# Altium schematic sheet lcd.SchDoc
size A4
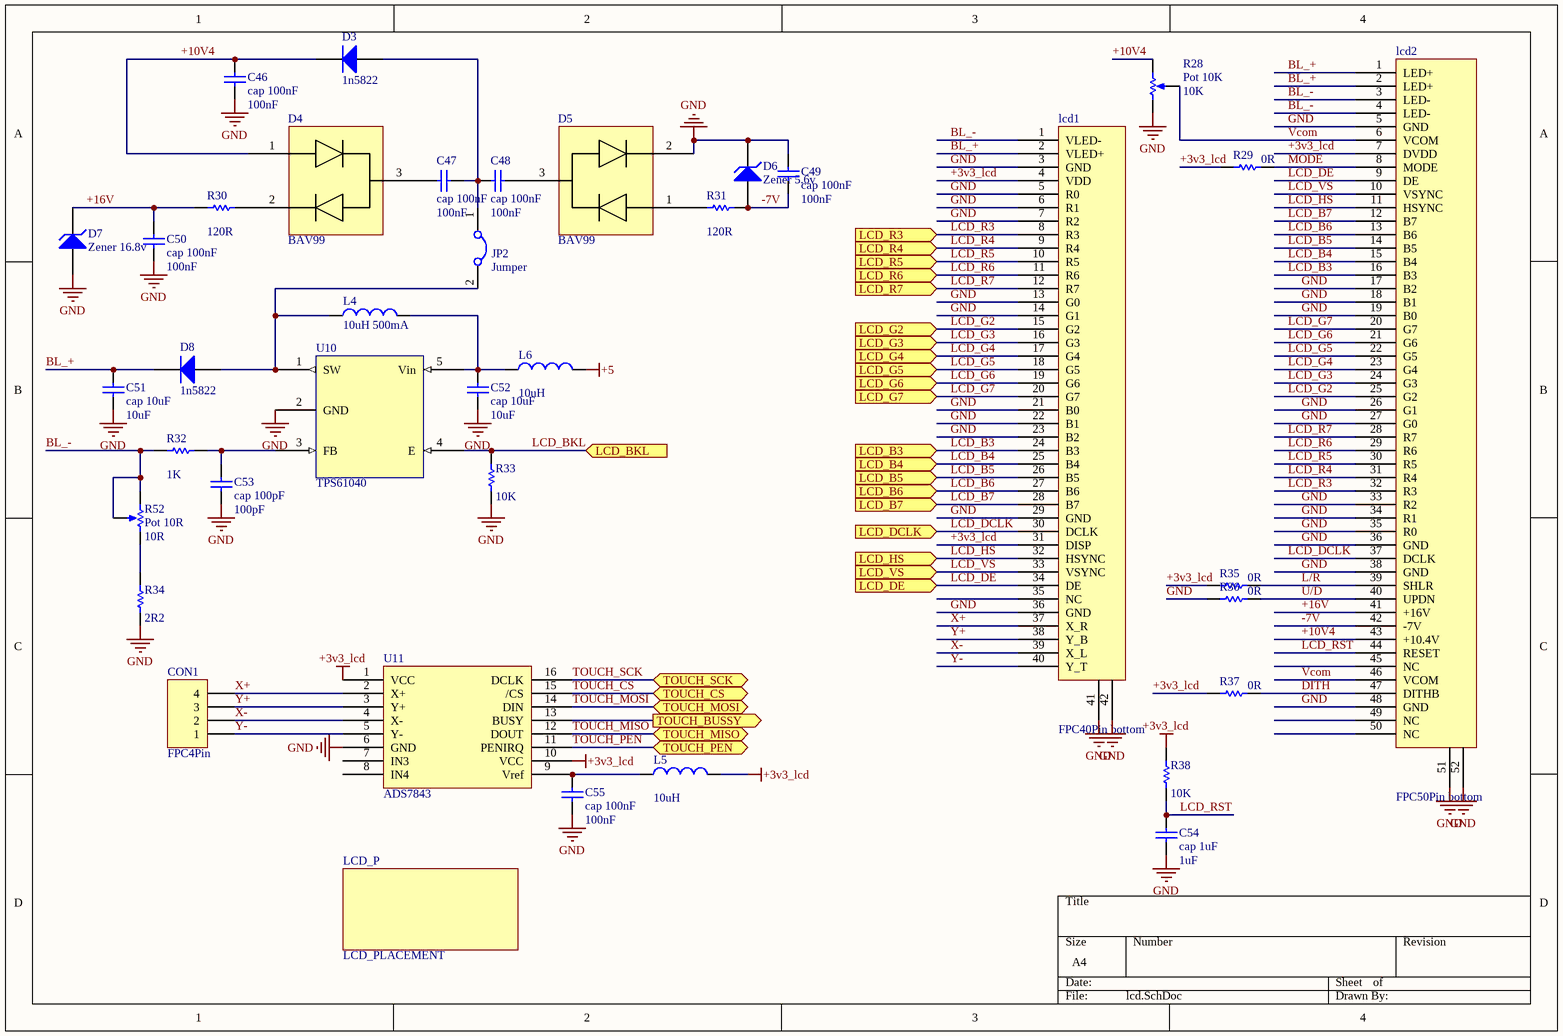
[diagram p0: lcd.SchDoc]

## Parts
C46  cap 100nF  value 100nF  [Cap 805]
C47  cap 100nF  value 100nF  [Cap 805]
C48  cap 100nF  value 100nF  [Cap 805]
C49  cap 100nF  value 100nF  [Cap 805]
C50  cap 100nF  value 100nF  [Cap 805]
C51  cap 10uF  value 10uF  [Cap 805]
C52  cap 10uF  value 10uF  [Cap 805]
C53  cap 100pF  value 100pF  [Cap 805]
C54  cap 1uF  value 1uF  [Cap 805]
C55  cap 100nF  value 100nF  [Cap 805]
CON1  FPC4Pin  [FPC-4pin-1mm]
D3  1n5822  [SMA DIODE 2]
D4  BAV99  [SOT23_BEC_N]
D5  BAV99  [SOT23_BEC_N]
D6  Zener 5.6v  [Diode 1n4148 SMD]
D7  Zener 16.8v  [Diode 1n4148 SMD]
D8  1n5822  [SMA DIODE 2]
JP2  Jumper  [Jumper Small - 2.54 - GRAY]  (no BOM)
L4  value 10uH 500mA  [Inductor SMD 3x3.2mm]  (hidden comment: inductor 10uH 500mA)
L5  value 10uH  [IND1206]  (hidden comment: inductor 10uH)
L6  value 10uH  [IND1206]  (hidden comment: inductor 10uH)
lcd1  FPC40Pin bottom  [FPC40]
lcd2  FPC50Pin bottom  [FPC50pin]
LCD_P  LCD_PLACEMENT  [LCD_7"_placement]  (no BOM)
R28  Pot 10K  value 10K  [Multi Turn 02]
R29  value 0R  [RES 0805 (2012X06L)]  (hidden comment: Res 0R)
R30  value 120R  [RES 0805 (2012X06L)]  (hidden comment: Res 120R)
R31  value 120R  [RES 0805 (2012X06L)]  (hidden comment: Res 120R)
R32  value 1K  [RES 0805 (2012X06L)]  (hidden comment: Res 1K)
R33  value 10K  [RES 0805 (2012X06L)]  (hidden comment: Res 10K)
R34  value 2R2  [RES 0805 (2012X06L)]  (hidden comment: Res 2R2)
R35  value 0R  [RES 0805 (2012X06L)]  (hidden comment: Res 0R)
R36  value 0R  [RES 0805 (2012X06L)]  (hidden comment: Res 0R)
R37  value 0R  [RES 0805 (2012X06L)]  (hidden comment: Res 0R)
R38  value 10K  [RES 0805 (2012X06L)]  (hidden comment: Res 10K)
R52  Pot 10R  value 10R  [Multi Turn 02]
U10  TPS61040  [SOT23-5_N]
U11  ADS7843  [XPT]

## Ports
LCD_B3 (in), LCD_B4 (in), LCD_B5 (in), LCD_B6 (in), LCD_B7 (in), LCD_BKL (in), LCD_DCLK (in), LCD_DE (in), LCD_G2 (in), LCD_G3 (in), LCD_G4 (in), LCD_G5 (in), LCD_G6 (in), LCD_G7 (in), LCD_HS (in), LCD_R3 (in), LCD_R4 (in), LCD_R5 (in), LCD_R6 (in), LCD_R7 (in), LCD_VS (in), TOUCH_BUSSY (out), TOUCH_CS (bidir), TOUCH_MISO (bidir), TOUCH_MOSI (bidir), TOUCH_PEN (bidir), TOUCH_SCK (bidir)

## Nets
+3v3_lcd: L5.2 lcd1.4(VDD) lcd1.31(DISP) lcd2.7(DVDD) R29.2 R35.2 R37.2 R38.2 U11.1(VCC) U11.10(VCC)
+5: L6.2
GND: C46.2 C49.1 C50.2 C51.2 C52.2 C53.2 C54.1 C55.2 D5.2 D6.2(K) D7.1(A) lcd1.3(GND) lcd1.5(R0) lcd1.6(R1) lcd1.7(R2) lcd1.13(G0) lcd1.14(G1) lcd1.21(B0) lcd1.22(B1) lcd1.23(B2) lcd1.29(GND) lcd1.36(GND) lcd1.41 lcd1.42 lcd2.5(GND) lcd2.17(B2) lcd2.18(B1) lcd2.19(B0) lcd2.26(G1) lcd2.27(G0) lcd2.33(R2) lcd2.34(R1) lcd2.35(R0) lcd2.36(GND) lcd2.38(GND) lcd2.48(GND) lcd2.51 lcd2.52 R28.1(TOP) R33.1 R34.1 R36.2 U10.2(GND) U11.6(GND)
+10V4: C46.1 D3.2(K) D4.1 lcd2.43(+10.4V) R28.2(BOT)
+16V: C50.1 D7.2(K) lcd2.41(+16V) R30.2
-7V: C49.2 D6.1(A) lcd2.42(-7V) R31.1
BL_+: C51.1 D8.2(K) lcd1.2(VLED+) lcd2.1(LED+) lcd2.2(LED+)
BL_-: lcd1.1(VLED-) lcd2.3(LED-) lcd2.4(LED-) R32.2 R52.1(TOP) R52.3(TAP)
DITH: lcd2.47(DITHB) R37.1
L/R: lcd2.39(SHLR) R35.1
LCD_B3: lcd1.24(B3) lcd2.16(B3) ; port LCD_B3
LCD_B4: lcd1.25(B4) lcd2.15(B4) ; port LCD_B4
LCD_B5: lcd1.26(B5) lcd2.14(B5) ; port LCD_B5
LCD_B6: lcd1.27(B6) lcd2.13(B6) ; port LCD_B6
LCD_B7: lcd1.28(B7) lcd2.12(B7) ; port LCD_B7
LCD_BKL: R33.2 U10.4(E) ; port LCD_BKL
LCD_DCLK: lcd1.30(DCLK) lcd2.37(DCLK) ; port LCD_DCLK
LCD_DE: lcd1.34(DE) lcd2.9(DE) ; port LCD_DE
LCD_G2: lcd1.15(G2) lcd2.25(G2) ; port LCD_G2
LCD_G3: lcd1.16(G3) lcd2.24(G3) ; port LCD_G3
LCD_G4: lcd1.17(G4) lcd2.23(G4) ; port LCD_G4
LCD_G5: lcd1.18(G5) lcd2.22(G5) ; port LCD_G5
LCD_G6: lcd1.19(G6) lcd2.21(G6) ; port LCD_G6
LCD_G7: lcd1.20(G7) lcd2.20(G7) ; port LCD_G7
LCD_HS: lcd1.32(HSYNC) lcd2.11(HSYNC) ; port LCD_HS
LCD_R3: lcd1.8(R3) lcd2.32(R3) ; port LCD_R3
LCD_R4: lcd1.9(R4) lcd2.31(R4) ; port LCD_R4
LCD_R5: lcd1.10(R5) lcd2.30(R5) ; port LCD_R5
LCD_R6: lcd1.11(R6) lcd2.29(R6) ; port LCD_R6
LCD_R7: lcd1.12(R7) lcd2.28(R7) ; port LCD_R7
LCD_RST: C54.2 lcd2.44(RESET) R38.1
LCD_VS: lcd1.33(VSYNC) lcd2.10(VSYNC) ; port LCD_VS
MODE: lcd2.8(MODE) R29.1
TOUCH_BUSSY: U11.13(BUSY) ; port TOUCH_BUSSY
TOUCH_CS: U11.15(/CS) ; port TOUCH_CS
TOUCH_MISO: U11.12(DOUT) ; port TOUCH_MISO
TOUCH_MOSI: U11.14(DIN) ; port TOUCH_MOSI
TOUCH_PEN: U11.11(PENIRQ) ; port TOUCH_PEN
TOUCH_SCK: U11.16(DCLK) ; port TOUCH_SCK
U/D: lcd2.40(UPDN) R36.1
Vcom: lcd2.6(VCOM) lcd2.46(VCOM) R28.3(TAP)
X+: CON1.4 lcd1.37(X_R) U11.2(X+)
X-: CON1.2 lcd1.39(X_L) U11.4(X-)
Y+: CON1.3 lcd1.38(Y_B) U11.3(Y+)
Y-: CON1.1 lcd1.40(Y_T) U11.5(Y-)
NetC47_1: C47.1 C48.2 D3.1(A) JP2.1
NetC47_2: C47.2 D4.3
NetC48_1: C48.1 D5.3
NetC52_1: C52.1 L4.2 L6.1 U10.5(Vin)
NetC53_1: C53.1 R32.1 U10.3(FB)
NetC55_1: C55.1 L5.1 U11.9(Vref)
NetD4_2: D4.2 R30.1
NetD5_1: D5.1 R31.2
NetD8_1: D8.1(A) JP2.2 L4.1 U10.1(SW)
NetR34_2: R34.2 R52.2(BOT)

Not connected (* = marked no-connect by the designer): lcd1 35(NC); lcd2 45(NC) 49(NC) 50(NC); U11 7(IN3) 8(IN4)

## Library data of the parts
C46-C55 = Cap: Capacitor; Published: 8-Jun-2000; LatestRevisionDate: 17-Jul-2002; LatestRevisionNote: Re-released for DXP Platform.; PackageReference: RAD-0.3; Publisher: Altium Limited; PackageDescription: Radial Cap, Thru-Hole; 2 Leads; 0.3 in Pin Spacing
CON1 = Header 4: touchpad FPC; LatestRevisionDate: 17-Jul-2002; LatestRevisionNote: Re-released for DXP Platform.; Publisher: Altium Limited
D3 D8 = Diode 1N4007: 1 Amp schottky Diode; Published: 8-Jun-2000; LatestRevisionDate: 17-Jul-2002; LatestRevisionNote: Re-released for DXP Platform.; DatasheetVersion: 1998; PackageVersion: Aug-1999; PackageReference: DO-41; Publisher: Altium Limited; PackageDescription: Diode, Axial; Body 5.2 x 2.7 mm (LxDia. max), Lead Dia. 0.86 mm (max); Code_JEDEC: DO-204-AL; ComponentLink1Description: Manufacturer Link; ComponentLink1URL: http://www.fairchildsemi.com/; ComponentLink2Description: Datasheet; ComponentLink2URL: http://www.fairchildsemi.com/ds/1N%2F1N4001.pdf
D4 D5 = BAV99: Schottky Diode package
D6 D7 = D Zener: Zener Diode; Published: 8-Jun-2000; LatestRevisionDate: 17-Jul-2002; LatestRevisionNote: Re-released for DXP Platform.; PackageReference: DIODE-0.7; Publisher: Altium Limited; PackageDescription: Diode, Thru-Hole; 2 Leads; 0.7 in Pin Spacing
JP2 = Jumper: 50pin lcd select; Company: E.P.I.L; Defualt State: Close; Design Date: 2011/11/02
L4 = Inductor: Inductor 3*3.2mm; Code_IEC: 1005; Published: 8-Jun-2000; LatestRevisionDate: 29-May-2009; LatestRevisionNote: IPC-7351 Footprint Added.; PackageReference: 0402-A; Publisher: Altium Limited; PackageDescription: Chip Inductor; Code_JEITA: 0402
L5 L6 = Inductor: Code_IEC: 1005; Published: 8-Jun-2000; LatestRevisionDate: 29-May-2009; LatestRevisionNote: IPC-7351 Footprint Added.; PackageReference: 0402-A; Publisher: Altium Limited; PackageDescription: Chip Inductor; Code_JEITA: 0402
lcd1 = LCD_40pin: 4.3" RGB LCD
lcd2 = LCD_50pin: 7" LCD
R28 R52 = RPot: Potentiometer; Sim Note: Enter the Resistance value and the set point into parameter fields.; Set Position: 0.5; Published: 8-Jun-2000; LatestRevisionDate: 17-Jul-2002; LatestRevisionNote: Re-released for DXP Platform.; PackageReference: VR5; Publisher: Altium Limited; PackageDescription: Variable Resistor, Thru-Hole; 3 Leads
R29-R38 = Res1: Resistor; Published: 8-Jun-2000; LatestRevisionDate: 17-Jul-2002; LatestRevisionNote: Re-released for DXP Platform.; PackageReference: AXIAL-0.3; Publisher: Altium Limited; PackageDescription: Axial Device, Thru-Hole; 2 Leads; 0.3 in Pin Spacing
U10 = TPS61040: pwm led controller
U11 = ADS7843: SPI touch